# EasyEDA Pro project ELECAP.eprj, board PCB1
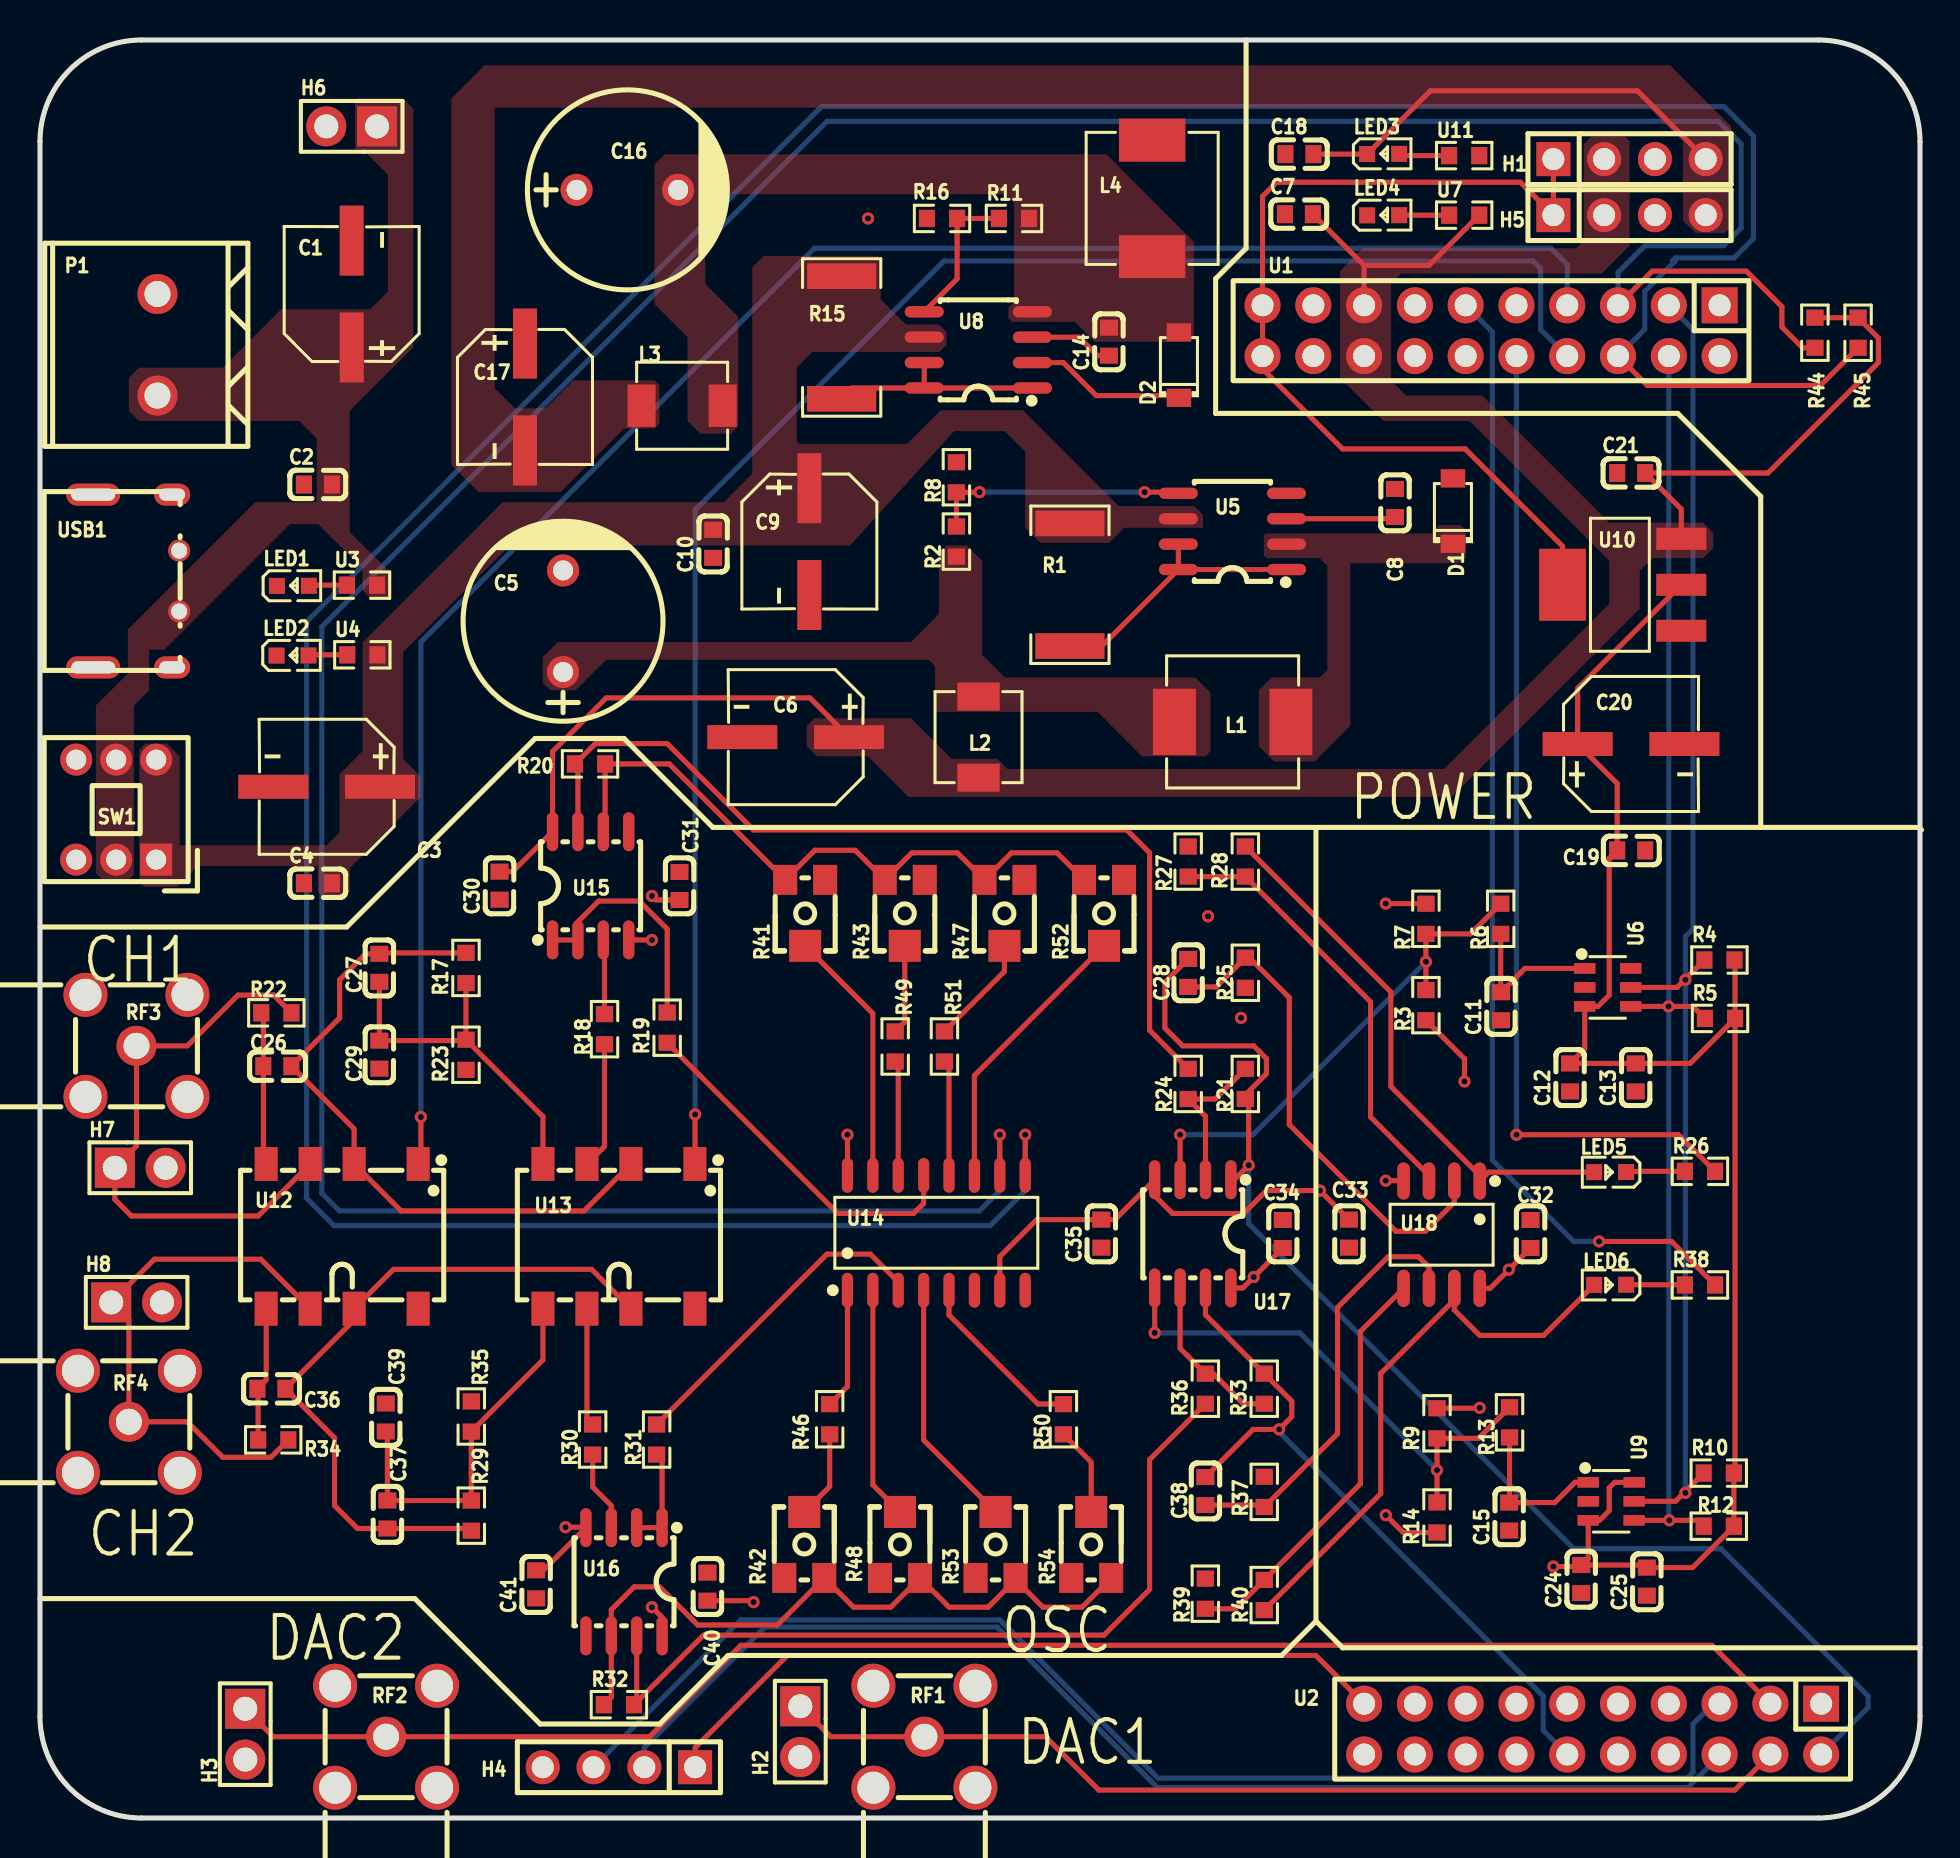
[diagram p2: board, top side]
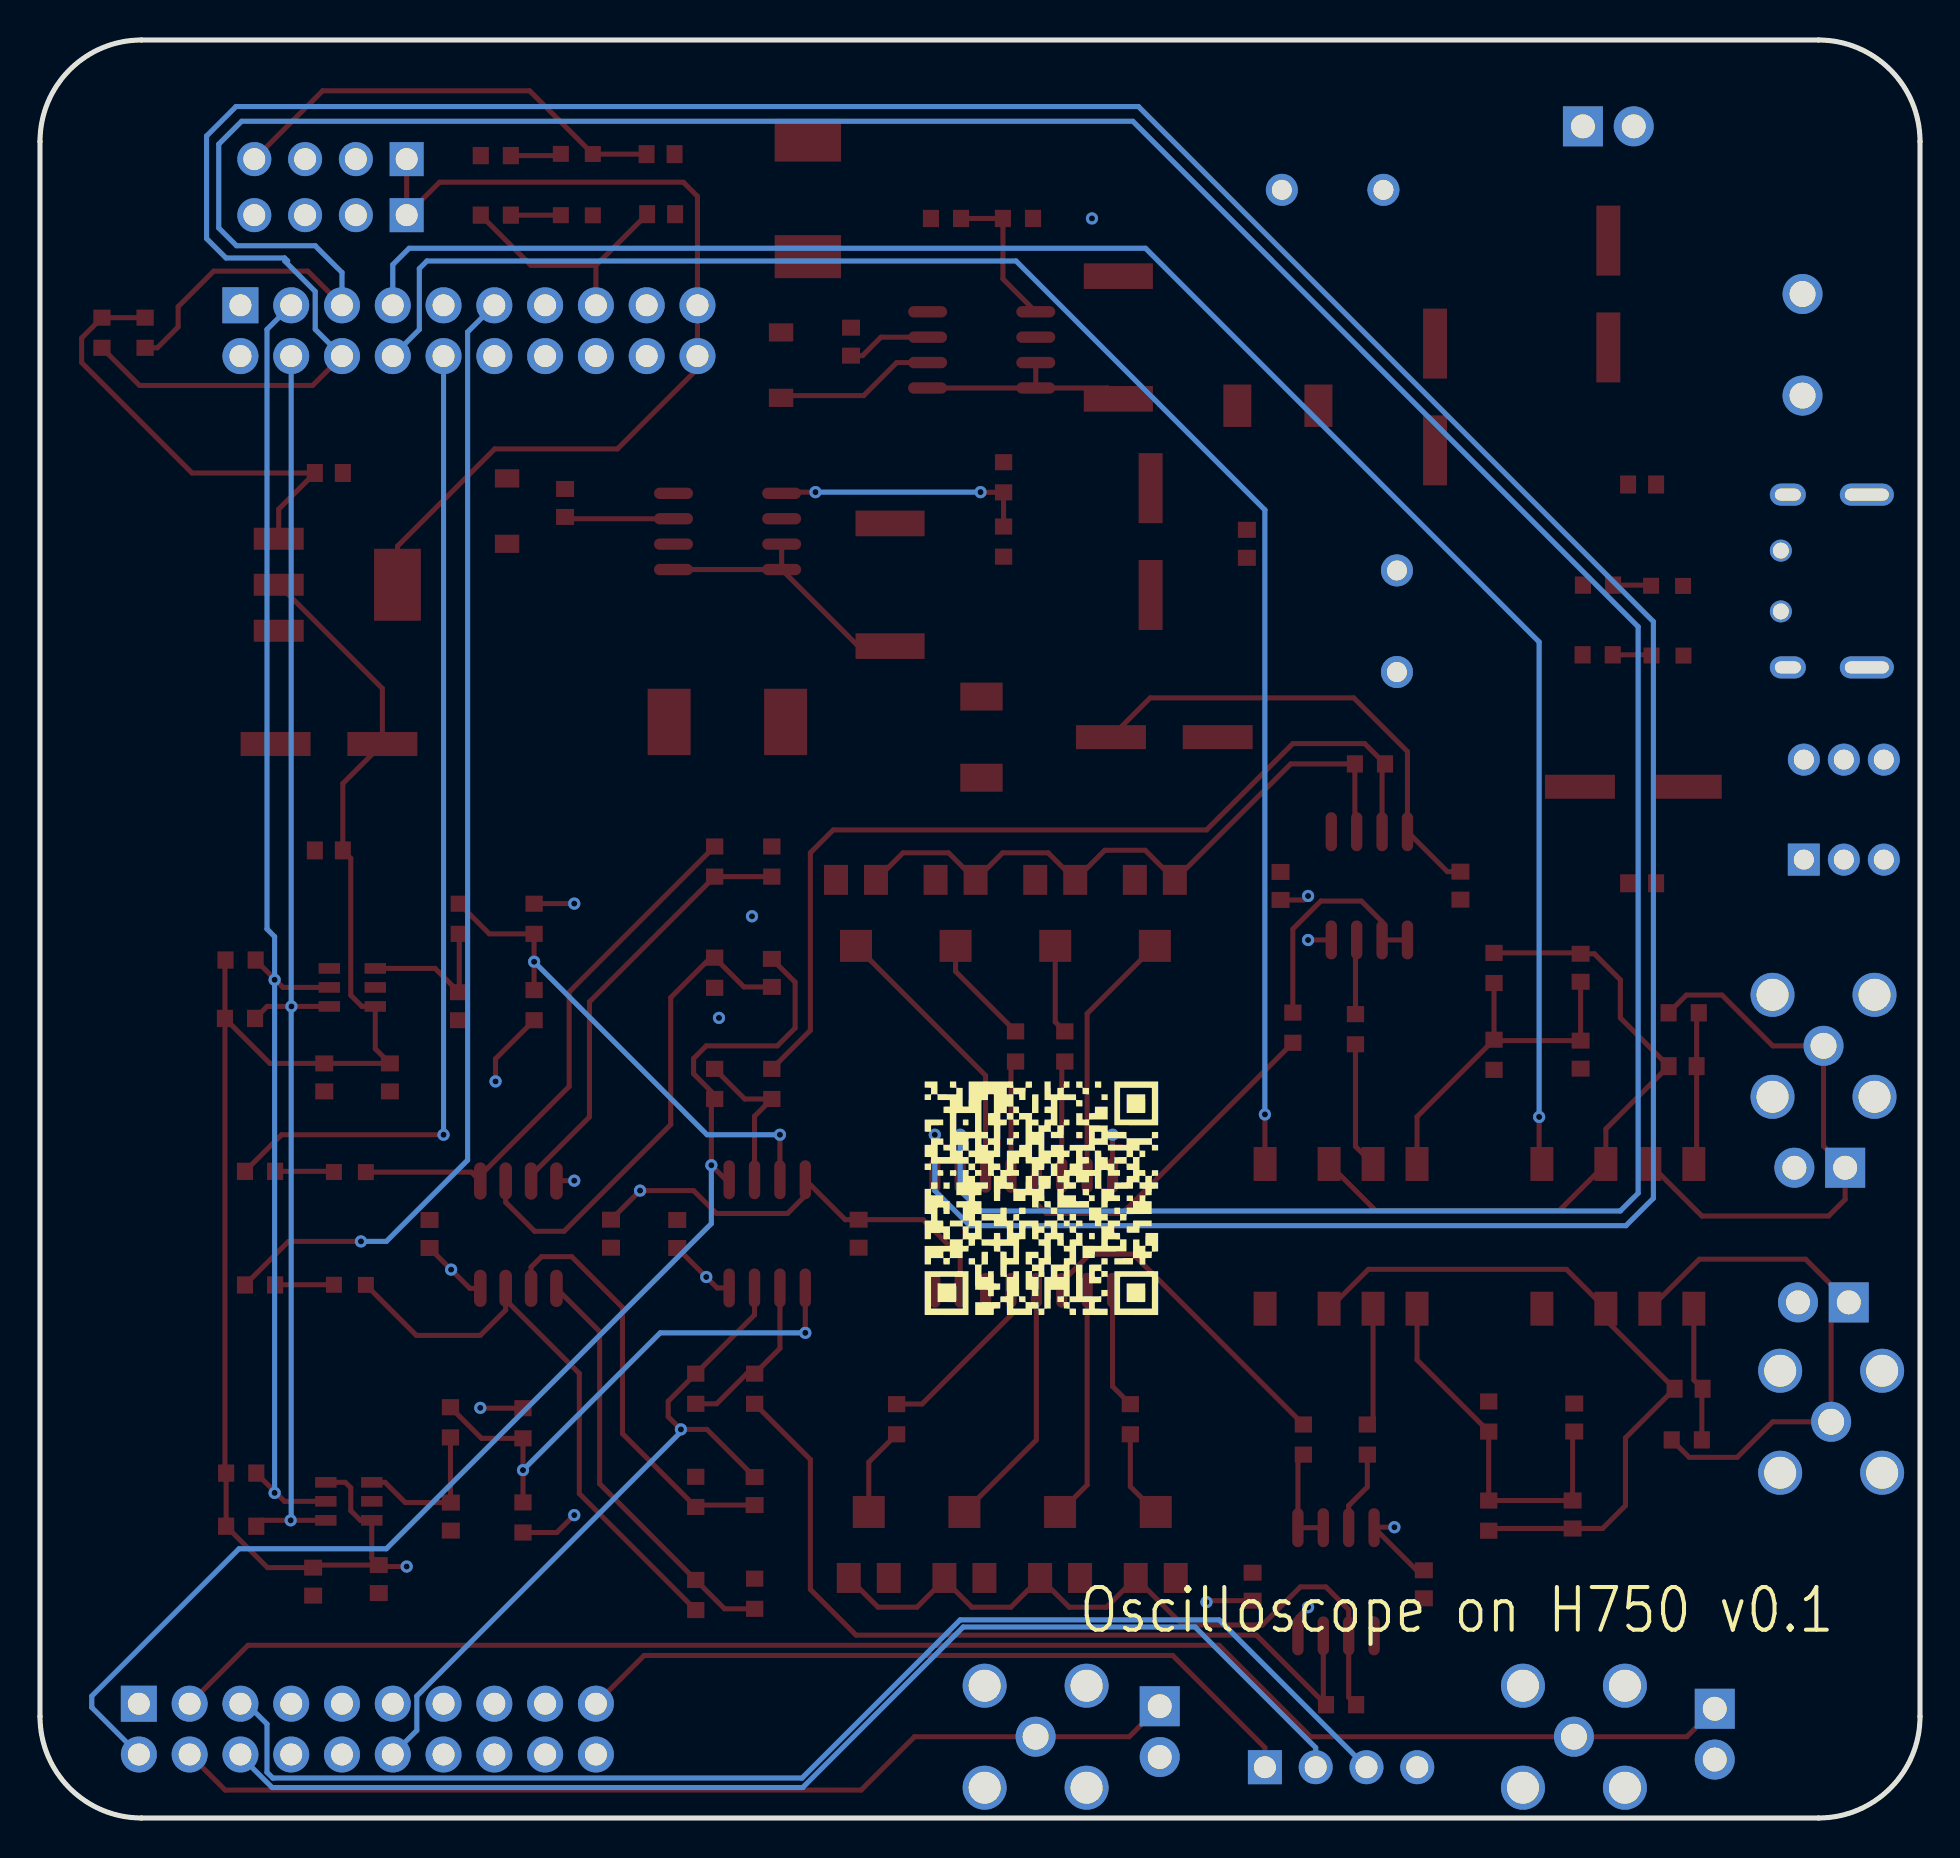
[diagram p3: board, bottom side, seen from below]

Outline 94.03 x 88.9 mm; copper layers: Top Layer, Inner1, Inner2, Bottom Layer. Coordinates in mm from the lower left corner of the outline.
Outline path: 0,83.82 0,5.08 arc(1.49,1.49) 5.08,0 88.95,0 arc(92.54,1.49) 94.03,5.08 94.03,83.82 arc(92.54,87.41) 88.95,88.9 5.08,88.9 arc(1.49,87.41) 0,83.82
Stack: Top Layer 0.035mm 外层铜厚1oz / Dielectric1 0.2104mm 7628 RC49% 8.6mil / Inner1 0.0152mm 内层铜厚 / Dielectric2 1.065mm 1.1mm H/HOZ 含铜 / Inner2 0.0152mm 内层铜厚 / Dielectric3 0.2104mm 7628 RC49% 8.6mil / Bottom Layer 0.035mm 外层铜厚1oz

## Design rules (mm)
template: JLCPCB Capability(Two Layers Board)
spacing copperThickness1oz (default): track to track 0.102, other pairs 0.152 to 0.3
spacing copperThickness2oz: track to track 0.203, other pairs 0.152 to 0.3
track width copperThickness1oz (default): min 0.127, default 0.254, max 2.54
track width copperThickness2oz: min 0.203, default 0.254, max 2.54
differential pair differentialPair (default): width min 0.127, default 0.254, max 2.54; gap min 0.152, default 0.152
via viaSize (default): diameter min 0.5, default 0.61, max 10; hole min 0.3, default 0.305, max 6.3

## Placement (name value [footprint] x y rotation side)
C1  100uF  [CAP-SMD_BD6.3-L6.6-W6.6-LS7.4-FD]  15.59 76.2 90 top
C2  100nF  [C0603]  13.9 66.67 0 top
C3  100uF  [CAP-SMD_BD6.3-L6.6-W6.6-LS7.4-FD]  14.34 51.56 180 top
C4  100nF  [C0603]  13.9 46.74 0 top
C5  1000uF  [CAP-TH_BD10.0-P5.00-D1.0-FD]  26.16 59.84 90 top
C6  100uF  [CAP-SMD_BD6.3-L6.6-W6.6-LS7.4-FD]  37.8 54.04 180 top
C7  100nF  [C0603]  62.96 80.19 0 top
C8  470pF  [C0603]  67.77 65.75 270 top
C9  100uF  [CAP-SMD_BD6.3-L6.6-W6.6-LS7.4-FD]  38.48 63.82 270 top
C10  100nF  [C0603]  33.67 63.71 90 top
C11  100nF  [C0603]  73.08 40.59 90 top
C12  100nF  [C0603]  76.53 37.03 90 top
C13  10uF  [C0603]  79.81 37.03 90 top
C14  470pF  [C0603]  53.47 73.82 90 top
C15  100nF  [C0603]  73.48 15.07 90 top
C16  1000uF  [CAP-TH_BD10.0-P5.00-D1.0-FD]  29.38 81.41 0 top
C17  100uF  [CAP-SMD_BD6.3-L6.6-W6.6-LS7.4-FD]  24.26 71.05 270 top
C18  100nF  [C0603]  62.99 83.19 0 top
C19  100nF  [C0603]  79.58 48.38 180 top
C20  100uF  [CAP-SMD_BD6.3-L6.6-W6.6-LS7.4-FD]  79.58 53.7 0 top
C21  100nF  [C0603]  79.58 67.25 0 top
C24  100nF  [C0603]  77.09 11.95 90 top
C25  10uF  [C0603]  80.37 11.82 90 top
C26  3.3uF  [C0603]  11.87 37.59 180 top
C27  10pF  [C0603]  16.98 42.51 90 top
C28  3.3uF  [C0603]  57.43 42.25 270 top
C29  220pF  [C0603]  16.98 38.17 90 top
C30  100nF  [C0603]  22.99 46.62 90 top
C31  100nF  [C0603]  31.99 46.6 270 top
C32  100nF  [C0603]  74.55 29.2 270 top
C33  100nF  [C0603]  65.47 29.22 90 top
C34  100nF  [C0603]  62.16 29.2 270 top
C35  100nF  [C0603]  53.09 29.22 90 top
C36  3.3uF  [C0603]  11.57 21.46 180 top
C37  10pF  [C0603]  17.38 15.18 270 top
C38  3.3uF  [C0603]  58.29 16.35 270 top
C39  220pF  [C0603]  17.3 20.02 270 top
C40  100nF  [C0603]  33.38 11.57 270 top
C41  100nF  [C0603]  24.82 11.68 90 top
D1  1N5819HW-7-F  [SOD-123_L2.7-W1.6-LS3.7-RD]  70.67 65.34 90 top
D2  1N5819HW-7-F  [SOD-123_L2.7-W1.6-LS3.7-RD]  56.97 72.64 90 top
H1  PZ254V-11-04P  [HDR-TH_4P-P2.54-V-M]  79.5 82.94 0 top
H2  PZ254V-11-02P  [HDR-TH_2P-P2.54-V-M]  38.03 4.32 270 top
H3  PZ254V-11-02P  [HDR-TH_2P-P2.54-V-M]  10.27 4.19 270 top
H4  PZ254V-11-04P  [HDR-TH_4P-P2.54-V-M]  28.96 2.54 180 top
H5  PZ254V-11-04P  [HDR-TH_4P-P2.54-V-M]  79.5 80.14 0 top
H6  PZ254V-11-02P  [HDR-TH_2P-P2.54-V-M]  15.59 84.58 180 top
H7  PZ254V-11-02P  [HDR-TH_2P-P2.54-V-M]  5.01 32.51 0 top
H8  PZ254V-11-02P  [HDR-TH_2P-P2.54-V-M]  4.83 25.78 0 top
L1  100uH  [IND-SMD_L7.1-W6.6]  59.65 54.8 180 top
L2  1uH  [IND-SMD_L4.4-W4.2]  46.94 54.04 90 top
L3  1uH  [IND-SMD_L4.4-W4.2]  32.12 70.61 0 top
L4  100uH  [IND-SMD_L7.1-W6.6]  55.63 80.98 270 top
LED1  NCD0603R1  [LED0603-RD_RED]  12.65 61.61 0 top
LED2  NCD0603R1  [LED0603-RD_RED]  12.63 58.12 0 top
LED3  NCD0603R1  [LED0603-RD_RED]  67.18 83.2 0 top
LED4  NCD0603R1  [LED0603-RD_RED]  67.18 80.14 0 top
LED5  NCD0603R1  [LED0603-RD_RED]  78.53 32.3 180 top
LED6  NCD0603R1  [LED0603-RD_RED]  78.53 26.66 180 top
P1  WJ500V-5.08-2P  [CONN-TH_2P-P5.00_WJ500V-5.08-2P]  5.88 73.66 90 top
R1  33mΩ  [R2512]  51.51 61.66 270 top
R2  3.6kΩ  [R0603]  45.84 63.82 270 top
R3  47kΩ  [R0603]  69.32 40.64 270 top
R4  1.5kΩ  [R0603]  84 42.9 0 top
R5  1.5kΩ  [R0603]  84.03 39.98 0 top
R6  100kΩ  [R0603]  73.06 44.96 270 top
R7  47kΩ  [R0603]  69.32 44.96 270 top
R8  1.2kΩ  [R0603]  45.84 67.04 270 top
R9  47kΩ  [R0603]  69.87 19.74 90 top
R10  1.5kΩ  [R0603]  83.97 17.25 0 top
R11  1.2kΩ  [R0603]  48.72 79.98 0 top
R12  1.5kΩ  [R0603]  83.97 14.59 0 top
R13  100kΩ  [R0603]  73.5 19.78 270 top
R14  47kΩ  [R0603]  69.87 15.03 90 top
R15  33mΩ  [R2512]  40.1 74.03 270 top
R16  3.6kΩ  [R0603]  45.12 79.98 0 top
R17  953kΩ  [R0603]  21.31 42.5 90 top
R18  33Ω  [R0603]  28.24 39.44 90 top
R19  33Ω  [R0603]  31.37 39.52 270 top
R20  100kΩ  [R0603]  27.51 52.7 180 top
R21  6.8kΩ  [R0603]  60.29 36.7 270 top
R22  100kΩ  [R0603]  11.82 40.26 180 top
R23  47kΩ  [R0603]  21.31 38.16 90 top
R24  6.8kΩ  [R0603]  57.43 36.7 270 top
R25  160kΩ  [R0603]  60.29 42.26 90 top
R26  33Ω  [R0603]  83.03 32.33 0 top
R27  3.6kΩ  [R0603]  57.43 47.82 270 top
R28  160kΩ  [R0603]  60.29 47.82 90 top
R29  953kΩ  [R0603]  21.57 15.12 270 top
R30  33Ω  [R0603]  27.64 18.92 270 top
R31  33Ω  [R0603]  30.84 18.92 90 top
R32  100kΩ  [R0603]  28.96 5.66 0 top
R33  6.8kΩ  [R0603]  61.23 21.46 90 top
R34  100kΩ  [R0603]  11.67 18.91 180 top
R35  47kΩ  [R0603]  21.57 20.07 270 top
R36  6.8kΩ  [R0603]  58.29 21.46 90 top
R37  160kΩ  [R0603]  61.23 16.31 270 top
R38  33Ω  [R0603]  83.03 26.65 0 top
R39  3.6kΩ  [R0603]  58.29 11.21 270 top
R40  160kΩ  [R0603]  61.23 11.15 270 top
R41  2.2kΩ  [RES-ADJ-SMD_VG039NCH]  38.27 45.26 90 top
R42  2.2kΩ  [RES-ADJ-SMD_VG039NCH]  38.23 13.65 270 top
R43  2.2kΩ  [RES-ADJ-SMD_VG039NCH]  43.25 45.26 90 top
R44  1kΩ  [R0603]  88.77 74.26 90 top
R45  1kΩ  [R0603]  90.93 74.26 90 top
R46  8.2kΩ  [R0603]  39.5 19.94 270 top
R47  2.2kΩ  [RES-ADJ-SMD_VG039NCH]  48.24 45.26 90 top
R48  2.2kΩ  [RES-ADJ-SMD_VG039NCH]  43.01 13.65 270 top
R49  3kΩ  [R0603]  42.77 38.58 270 top
R50  3kΩ  [R0603]  51.19 19.94 270 top
R51  8.2kΩ  [R0603]  45.24 38.58 270 top
R52  2.2kΩ  [RES-ADJ-SMD_VG039NCH]  53.22 45.26 90 top
R53  2.2kΩ  [RES-ADJ-SMD_VG039NCH]  47.79 13.65 270 top
R54  2.2kΩ  [RES-ADJ-SMD_VG039NCH]  52.58 13.65 270 top
RF1  BWSMA-KWE-Z001  [SMA-TH_BWSMA-KWE-Z001]  44.23 4.06 270 top
RF2  BWSMA-KWE-Z001  [SMA-TH_BWSMA-KWE-Z001]  17.31 4.06 270 top
RF3  BWSMA-KWE-Z001  [SMA-TH_BWSMA-KWE-Z001]  4.83 38.61 180 top
RF4  BWSMA-KWE-Z001  [SMA-TH_BWSMA-KWE-Z001]  4.45 19.81 180 top
SW1  XKB7070-Z  [SW-TH_6P-L7.0-W7.0-P2.00]  3.81 50.42 270 top
U1  PM254-2-10-Z-8.5  [HDR-TH_20P-P2.54-V-F-R2-C10-S2.54]  72.58 74.36 180 top
U2  PM254-2-10-Z-8.5  [HDR-TH_20P-P2.54-V-F-R2-C10-S2.54]  77.66 4.44 180 top
U3  5kΩ  [R0603]  16.11 61.64 0 top
U4  5kΩ  [R0603]  16.12 58.16 0 top
U5  MC34063ADR2G  [SOIC-8_L5.0-W4.0-P1.27-LS6.0-BL]  59.64 64.33 90 top
U6  MCP4725A0T-E/CH  [SOT-23-6_L2.9-W1.6-P0.95-LS2.8-BL]  78.41 41.53 270 top
U7  5kΩ  [R0603]  71.23 80.14 0 top
U8  MC34063ADR2G  [SOIC-8_L5.0-W4.0-P1.27-LS6.0-BL]  46.93 73.41 90 top
U9  MCP4725A0T-E/CH  [SOT-23-6_L2.9-W1.6-P0.95-LS2.8-BL]  78.59 15.83 270 top
U10  AMS1117-3.3  [SOT-223-3_L6.5-W3.4-P2.30-LS7.0-BR]  79.12 61.66 0 top
U11  5kΩ  [R0603]  71.23 83.12 0 top
U12  G6K-2F-Y-TR DC3  [RELAY-SMD_G6K-2F-Y]  15.11 29.08 180 top
U13  G6K-2F-Y-TR DC3  [RELAY-SMD_G6K-2F-Y]  28.96 29.08 180 top
U14  CD4052BM/TR  [SOP-16_L10.0-W3.9-P1.27-LS6.0-BL]  44.83 29.26 0 top
U15  TL072CDR  [SOIC-8_L4.9-W3.9-P1.27-LS6.1-BL]  27.54 46.61 0 top
U16  TL072CDR  [SOIC-8_L4.9-W3.9-P1.27-LS6.1-BL]  29.21 11.81 180 top
U17  TL072CDR  [SOIC-8_L4.9-W3.9-P1.27-LS6.1-BL]  57.66 29.21 180 top
U18  LM393  [SOP-8_L4.9-W3.9-P1.27-LS6.0-BL]  70.1 29.17 180 top
USB1  TYPE-C-31-M-33  [USB-C-TH_TYPE-C-31-M-33]  4.81 61.85 270 top

## Footprints (pads in the part's own frame, mm; a bottom-side part is the same pattern mirrored in y, then rotated)
C0603
  rect 0.8x0.9 smd: 1(-0.7,0) 2(0.7,0)
CAP-SMD_BD6.3-L6.6-W6.6-LS7.4-FD
  rect 3.5x1.2 smd: 1(-2.67,0) 2(2.67,0)
CAP-TH_BD10.0-P5.00-D1.0-FD
  round 1.6 hole 1: 1(-2.54,0) 2(2.54,0)
CONN-TH_2P-P5.00_WJ500V-5.08-2P
  round 2 hole 1.3: 1(-2.54,0) 2(2.54,0)
HDR-TH_2P-P2.54-V-M
  rect 2x2 hole 1.2: 1(-1.27,0)
  round 2 hole 1.2: 2(1.27,0)
HDR-TH_4P-P2.54-V-M
  rect 1.7x1.7 hole 1.1: 1(-3.81,0)
  round 1.7 hole 1.1: 2(-1.27,0) 3(1.27,0) 4(3.81,0)
HDR-TH_20P-P2.54-V-F-R2-C10-S2.54
  rect 1.8x1.8 hole 1.1: 1(-11.43,-1.27)
  round 1.8 hole 1.1: 2(-11.43,1.27) 3(-8.89,-1.27) 4(-8.89,1.27) 5(-6.35,-1.27) 6(-6.35,1.27) 7(-3.81,-1.27) 8(-3.81,1.27) 9(-1.27,-1.27) 10(-1.27,1.27) 11(1.27,-1.27) 12(1.27,1.27) 13(3.81,-1.27) 14(3.81,1.27) 15(6.35,-1.27) 16(6.35,1.27) 17(8.89,-1.27) 18(8.89,1.27) 19(11.43,-1.27) 20(11.43,1.27)
IND-SMD_L4.4-W4.2
  rect 1.4x2.12 smd: 1(2.028,0) 2(-2.028,0)
IND-SMD_L7.1-W6.6
  rect 2.15x3.32 smd: 1(-2.913,0) 2(2.913,0)
LED0603-RD_RED
  rect 0.8x0.8 smd: 1(-0.799,-0.004) 2(0.799,0.004)
R0603
  rect 0.806x0.864 smd: 1(-0.753,0) 2(0.753,0)
R2512
  rect 1.282x3.456 smd: 1(-3.067,0) 2(3.067,0)
RELAY-SMD_G6K-2F-Y
  rect 1.15x1.7 smd: 1(-3.8,-3.618) 2(-0.6,-3.618) 3(1.6,-3.618) 4(3.8,-3.618) 5(3.8,3.618) 6(1.6,3.618) 7(-0.6,3.618) 8(-3.8,3.618)
RES-ADJ-SMD_VG039NCH
  rect 1.5x1.2 smd: 1(1.65,-1) 3(1.65,1)
  rect 1.6x1.6 smd: 2(-1.65,0)
SMA-TH_BWSMA-KWE-Z001
  round 2.2 hole 1.6: 1(-2.55,-2.55) 2(-2.55,2.55) 3(2.55,2.55) 4(2.55,-2.55)
  round 2 hole 1.3: 5(0,0)
SOD-123_L2.7-W1.6-LS3.7-RD
  rect 0.91x1.22 smd: 1(-1.635,0) 2(1.635,0)
SOIC-8_L4.9-W3.9-P1.27-LS6.1-BL
  oval 0.569x1.95 smd: 1(-1.905,-2.705) 2(-0.635,-2.705) 3(0.635,-2.705) 4(1.905,-2.705) 5(1.905,2.705) 6(0.635,2.705) 7(-0.635,2.705) 8(-1.905,2.705)
SOIC-8_L5.0-W4.0-P1.27-LS6.0-BL
  oval 0.569x1.95 smd: 1(-1.905,-2.705) 2(-0.635,-2.705) 3(0.635,-2.705) 4(1.905,-2.705) 5(1.905,2.705) 6(0.635,2.705) 7(-0.635,2.705) 8(-1.905,2.705)
SOP-8_L4.9-W3.9-P1.27-LS6.0-BL
  oval 0.63x1.865 smd: 1(-1.905,-2.683) 2(-0.635,-2.683) 3(0.635,-2.683) 4(1.905,-2.683) 5(1.905,2.683) 6(0.635,2.683) 7(-0.635,2.683) 8(-1.905,2.683)
SOP-16_L10.0-W3.9-P1.27-LS6.0-BL
  oval 0.56x1.745 smd: 1(-4.445,-2.873) 2(-3.175,-2.873) 3(-1.905,-2.873) 4(-0.635,-2.873) 5(0.635,-2.873) 6(1.905,-2.873) 7(3.175,-2.873) 8(4.445,-2.873) 9(4.445,2.873) 10(3.175,2.873) 11(1.905,2.873) 12(0.635,2.873) 13(-0.635,2.873) 14(-1.905,2.873) 15(-3.175,2.873) 16(-4.445,2.873)
SOT-23-6_L2.9-W1.6-P0.95-LS2.8-BL
  rect 0.532x1.072 smd: 1(-0.95,-1.149) 2(0,-1.149) 3(0.95,-1.149) 4(0.95,1.149) 5(0,1.149) 6(-0.95,1.149)
SOT-223-3_L6.5-W3.4-P2.30-LS7.0-BR
  rect 2.5x1.1 smd: 1(2.97,-2.3) 2(2.97,0) 3(2.97,2.3)
  rect 2.34x3.6 smd: 4(-2.97,0)
SW-TH_6P-L7.0-W7.0-P2.00
  rect 1.6x1.6 hole 1: 1(2.499,2)
  round 1.6 hole 1: 2(2.5,0) 3(2.5,-2) 4(-2.5,2) 5(-2.5,0) 6(-2.5,-2)
USB-C-TH_TYPE-C-31-M-33
  oval 1.1x1.8 hole 0.6x1.3: 3(4.32,1.8) 6(-4.32,1.8)
  oval 1.1x2.7 hole 0.6x2.2: 4(4.32,-2.15) 5(-4.32,-2.15)
  round 1.1 hole 0.8: A9(1.52,2.15) B12(-1.52,2.15)

## Nets
As in the schematic.

Pads without a net: R41 1; R42 1; R43 1; R47 1; R48 1; R52 1; R53 1; R54 1; SW1 3 6

## Via types
v1: diameter 0.61, hole 0.305, Top Layer to Bottom Layer, 36 vias

## Routing (per net, layer and track width the routed paths; a pad name or vN(x,y) marks a point on that pad's centre or on a via; arc(x,y) is an arc through that point)
+5V: length 303.5
  Top Layer w0.254: C30.2 23.64,47.32 U15.8 25.64,53.32 28.32,56.01 38.5,56.01 C6.1 ; v1(40.39,34.16) U14.16 ; C34.2 60.16,26.5 U17.8 ; v1(35.69,10.79) 35.62,10.87 C40.2 ; 88.77,75.02 90.93,75.02 91.95,74 91.95,72.77 86.43,67.25 C21.2 82.09,65.44 82.09,63.96 ; C32.2 v1(73.47,27.42) 72.53,26.48 U18.8 ; R3.2 71.25,37.96 v1(71.25,36.83) ; U7.2 69.47,77.63 66.23,77.63 ; C7.2 66.23,77.63 ; 66.23,77.63 U1.15 ; v1(72.01,20.51) 71.99,20.49 R9.2 ; v1(30.61,10.54) 31.12,10.03 U16.8
  Inner2 w0.254: v1(30.61,10.54) 30.86,10.79 v1(35.69,10.79) 36.7,9.78 67.06,9.78 72.01,14.73 v1(72.01,20.51) 72.01,22.61 74.17,24.77 74.17,26.67 71.25,29.59 v1(71.25,36.83) 73.15,38.73 75.31,38.73 89.53,52.96 89.53,75.69 84.71,80.52 84.71,83.44 83.31,84.84 75.43,84.84 U1.15 U1.16 66.23,60 v1(40.39,34.16) 40.39,32 43.94,28.45 59.31,28.45 v1(60.71,27.05)
-5V: length 222.4
  Top Layer w0.254: R14.1 68.18,14.27 v1(67.31,15.15) ; U14.7 48.01,28.07 49.86,29.92 C35.2 53.76,29.92 U17.4 55.75,31.11 56.64,30.23 60.2,30.23 61.34,31.37 v1(64.02,31.37) C33.2 ; C41.2 25.17,12.38 27.31,14.52 27.28,14.54 v1(26.29,14.54) ; v1(30.61,46.1) 30.81,45.9 C31.2 ; C18.2 66.37,83.19 LED3.1 69.54,86.36 79.9,86.36 H1.4 ; v1(30.61,43.9) 30.6,43.9 U15.4 ; v1(67.31,31.87) 68.18,31.87 U18.4 ; R7.1 69.31,45.72 v1(67.31,45.72)
  Inner2 w0.254: v1(30.61,46.1) v1(30.61,43.9) 30.61,40.13 26.29,35.81 v1(26.29,14.54) 26.29,13.97 28.45,11.81 66.04,11.81 67.31,13.08 v1(67.31,15.15) 67.31,31.37 ; H5.4 87.76,75.7 87.76,53.85 82.17,48.26 69.85,48.26 v1(67.31,45.72) v1(67.31,31.87) 67.31,31.37 ; 67.31,31.37 67.31,31.37 64.01,31.37
GND:
  vias: v1(41.42,79.98) v1(58.42,45.08) v1(60.07,40)
VCC: length 291.4
  Top Layer w0.254: R5.2 82.53,37.73 C13.2 C12.2 77.26,38.46 U6.3 77.92,40.58 78.49,41.14 78.49,47.98 C19.2 78.88,51.72 C20.1 76.91,56.48 U10.2 ; R5.2 84.78,42.87 R4.2 ; R5.2 84.78,17.31 R10.2 R12.2 82.65,12.52 C25.2 80.24,12.65 C24.2 ; v1(75.69,12.57) 77.01,12.57 C24.2 ; U2.19 63.81,8.13 37.38,8.13 32.77,3.52 H4.1 ; C24.2 77.44,13 U9.3 78,14.88 78.49,15.37 78.49,16.51 78.76,16.78 U9.6 ; H1.1 H5.1 74.05,81.79 61.85,81.79 61.15,81.09 U1.19 U1.20 61.15,72.46 65.15,68.45 71.29,68.45 76.15,63.59 U10.4
  Inner2 w0.254: U2.20 U2.19 73.08,12.57 v1(75.69,12.57) 90.93,27.81 90.93,76.2 85.72,81.41 85.72,83.82 83.19,86.36 71.87,86.36 U1.19
CH1_AC: length 7.7
  Top Layer w0.254: R22.2 11.17,40.15 C26.2 11.17,32.84 U12.4
CH1_AFTER_RES: length 33.3
  Top Layer w0.254: U15.6 28.27,49.4 R20.1 31.47,52.7 R41.3 38.75,48.39 40.77,48.39 R43.3 43.61,48.26 45.88,48.26 R47.3 48.59,48.26 50.87,48.26 R52.3
CH1_BEFORE_AMP: length 18
  Top Layer w0.254: R19.2 39.91,30.23 43.69,30.23 44.2,30.73 44.2,32.13
CH1_BY20: length 17.9
  Top Layer w0.254: R23.2 R17.1 ; R23.2 21.26,38.87 C29.2 C27.1 ; R23.2 25.16,35.06 25.16,32.7
CH1_DC: length 34.2
  Top Layer w0.254: U13.2 27.21,30.35 18.06,30.35 U12.2 15.71,34.45 C26.1 14.99,40 14.99,41.91 16.29,43.21 C27.2 17.02,43.26 R17.2
CH1_IN: length 28.5
  Top Layer w0.254: U12.3 10.91,30.1 4.57,30.1 3.74,30.93 3.74,32.51 4.83,33.59 RF3.5 7.37,38.61 9.91,41.15 11.68,41.15 R22.1
CH1_SAMPLE: length 6.4
  Top Layer w0.254: 27.36,32.7 28.24,33.58 R18.1
CH2_AC: length 6.8
  Top Layer w0.254: R34.2 10.91,21.43 C36.2 11.31,21.9 U12.5
CH2_AFTER_RES: length 35.8
  Top Layer w0.254: 48.79,11.91 50.16,10.54 52.12,10.54 R54.3 ; 48.79,11.91 47.42,10.54 45.47,10.54 R48.3 42.55,10.54 40.69,10.54 R42.3 36.88,9.65 32.89,9.65 30.99,11.56 29.72,11.56 28.58,10.41 U16.6 28.58,6.04 R32.1 ; 48.79,11.91 R53.3
CH2_BEFORE_AMP: length 16.6
  Top Layer w0.254: R31.2 39.36,28.19 41.53,28.19 42.93,26.8 U14.3
CH2_BY20: length 18.8
  Top Layer w0.254: C39.2 17.38,19.24 C37.1 17.38,15.87 21.57,15.87 R35.2 25.16,22.91 25.16,25.47
CH2_DC: length 35.1
  Top Layer w0.254: R29.2 21.46,14.47 C37.2 15.88,14.47 14.73,15.62 14.73,19 C36.1 15.71,24.9 U12.7 17.68,27.43 27.59,27.43 U13.7
CH2_IN: length 27.3
  Top Layer w0.254: U12.6 11.04,27.94 5.72,27.94 H8.1 4.45,24.9 RF4.5 7.37,19.81 9.14,18.03 11.55,18.03 R34.1
CH2_SAMPLE: length 5.9
  Top Layer w0.254: 27.36,25.47 27.36,19.96 R30.1
DAC1_BIAS: length 25.3
  Top Layer w0.254: v1(57.02,34.16) U17.3 ; R3.1 v1(69.32,42.81) R7.2 71.55,44.21 R6.1
  Bottom Layer w0.254: v1(57.02,34.16) 60.67,34.16 v1(69.32,42.81)
DAC2_BIAS: length 26.7
  Top Layer w0.254: R14.2 v1(69.87,17.39) R9.1 71.95,18.98 R13.1 ; U17.5 v1(55.75,24.26)
  Bottom Layer w0.254: v1(69.87,17.39) 63.01,24.26 v1(55.75,24.26)
DAC_SCL: length 68.4
  Top Layer w0.254: R4.1 81.88,41.53 U6.5 ; U9.5 81.8,15.83 R10.1
  Bottom Layer w0.254: v1(82.3,16.26) v1(82.3,41.91) 82.3,44.07 82.68,44.45 82.68,74.42 U1.3
DAC_SDA: length 65.8
  Top Layer w0.254: R12.1 82.92,14.88 v1(81.49,14.88) U9.4 ; U6.4 v1(81.45,40.58) 82.67,40.58 R5.1
  Bottom Layer w0.254: U1.4 81.47,14.86
GPIO_ADC1: length 64.3
  Top Layer w0.254: C28.1 56.26,41.79 56.26,39.5 57.15,38.61 60.71,38.61 61.34,37.97 61.34,37.21 60.29,36.16 R21.2 60.45,35.78 v1(60.45,32.64) 59.73,31.91 U17.1
  Bottom Layer w0.254: v1(60.45,32.64) 60.45,29.72 76.71,13.46 84.07,13.46 91.44,6.1 91.44,5.53 U2.2
GPIO_ADC2: length 36.1
  Top Layer w0.254: C38.1 60.67,19.43 v1(61.98,19.43) 62.61,20.07 62.61,20.84 R33.2 58.29,25.16 U17.7
  Bottom Layer w0.254: 61.85,19.43 75.18,6.1 75.18,4.38 U2.12
GPIO_CD4052_A0: length 175.4
  Top Layer w0.254: R44.1 88.16,73.51 87.12,74.55 87.12,75.56 85.34,77.34 80.63,77.34 U1.5 ; v1(48.01,34.16) U14.10
  Bottom Layer w0.254: v1(48.01,34.16) 48.01,31.37 46.99,30.35 14.99,30.35 14.1,31.24 14.1,59.56 39.37,84.84 83.95,84.84 85.09,83.69 85.09,79.5 84.2,78.61 80.26,78.61 78.93,77.28 U1.5
GPIO_CD4052_A1: length 183.7
  Top Layer w0.254: v1(49.28,34.16) U14.9 ; R45.1 89.05,71.63 80.39,71.63 U1.6
  Bottom Layer w0.254: v1(49.28,34.16) 49.28,31.37 47.52,29.62 14.71,29.62 13.34,30.99 13.34,59.82 39.09,85.57 84.23,85.57 85.7,84.1 85.7,78.97 84.73,78 81.8,78 81.65,77.85 81.79,77.85 80.26,76.33 80.26,74.43 U1.6
GPIO_DAC1: length 51
  Top Layer w0.254: 38.03,5.59 39.55,4.06 RF1.5 50.29,4.06 52.96,1.4 84.77,1.4 U2.4
GPIO_DAC2: length 80
  Top Layer w0.254: H3.1 11.66,4.06 RF2.5 30.48,4.06 35.05,8.64 83.63,8.64 U2.3
GPIO_FREQ1: length 49.6
  Top Layer w0.254: R26.2 81.95,34.16 v1(73.85,34.16)
  Bottom Layer w0.254: U1.10 v1(73.85,34.16)
GPIO_FREQ2: length 57
  Top Layer w0.254: v1(77.98,28.83) 81.6,28.83 R38.2
  Bottom Layer w0.254: v1(77.98,28.83) 76.71,28.83 72.64,32.89 72.64,74.3 U1.11
GPIO_SW1: length 94
  Top Layer w0.254: U12.1 19.05,32.84 v1(19.05,35.05)
  Bottom Layer w0.254: U1.7 76.39,77.66 75.56,78.49 38.74,78.49 19.05,58.8 v1(19.05,35.05)
GPIO_SW2: length 85.2
  Top Layer w0.254: 32.76,32.7 32.77,32.71 v1(32.77,35.18)
  Bottom Layer w0.254: U1.8 75.06,74.42 75.06,77.47 74.68,77.85 45.21,77.85 32.77,65.41 v1(32.77,35.18)
UART1_RX: length 65.6
  Bottom Layer w0.254: U2.5 83.69,5.72 82.68,4.7 82.68,2.29 82.39,2 55.92,2 48.01,9.91 35.05,9.91 H4.3
UART1_TX: length 61.3
  Bottom Layer w0.254: H4.2 30.23,3.52 36.26,9.55 47.86,9.55 55.88,1.52 82.42,1.52 84.01,3.11 U2.6
$1N1475: length 1.9
  Top Layer w0.254: 15.35,61.64 13.48,61.64 LED1.2
$1N1576: length 2
  Top Layer w0.254: 15.37,58.16 13.46,58.16 LED2.2
$1N1922: length 5.5
  Top Layer w0.254: U5.3 67.68,64.96 C8.2
$1N2334: length 12.8
  Top Layer w0.254: U5.5 56.88,66.29 v1(55.25,66.29) ; R2.1 R8.2 46.98,66.28 v1(46.99,66.29)
  Bottom Layer w0.254: v1(46.99,66.29) v1(55.25,66.29)
$1N2471: length 13.7
  Top Layer w0.254: U5.8 53.11,58.6 R1.2 ; U5.8 56.94,63.69 ; U5.8 U5.1
$1N3516: length 7.4
  Top Layer w0.254: U8.5 45.87,76.95 45.87,79.98 R11.1
$1N3519: length 11
  Top Layer w0.254: R15.2 40.64,71.5 U8.8 ; U8.8 49.64,71.5 ; U8.8 U8.7
$1N3959: length 8.1
  Top Layer w0.254: D2.1 56.85,71.12 52.83,71.12 51.18,72.77 49.64,72.77
$1N3963: length 4.2
  Top Layer w0.254: C14.1 52.89,73.12 51.97,74.04 49.64,74.04
$1N4188: length 2.5
  Top Layer w0.254: LED4.2 70.48,80.14 U7.1
$1N4271: length 2.5
  Top Layer w0.254: U11.1 68.07,83.12 LED3.2
$1N10509: length 3.7
  Top Layer w0.254: R18.2 28.24,43.84 U15.3
$1N10723: length 11.8
  Top Layer w0.254: U15.1 U15.2 26.91,44.81 27.94,45.85 29.97,45.85 31.37,44.45 R19.1
$1N11101: length 5.8
  Top Layer w0.254: R51.2 45.47,37.59 U14.12
$1N11140: length 5.8
  Top Layer w0.254: R49.2 42.93,37.67 U14.14
$1N11181: length 4.5
  Top Layer w0.254: R43.2 43.25,39.81 R49.1
$1N11262: length 5.5
  Top Layer w0.254: R47.2 48.24,42.33 R51.1
$1N11378: length 14.2
  Top Layer w0.254: U14.11 46.74,37.12 R52.2
$1N12541: length 4
  Top Layer w0.254: R30.2 27.64,16.55 28.58,15.62 28.58,14.52
$1N12545: length 5
  Top Layer w0.254: 29.84,14.52 31.12,14.52 31.12,17.9 R31.1
$1N15287: length 6.1
  Top Layer w0.254: R46.1 40.39,21.58 U14.1
$1N15326: length 8.8
  Top Layer w0.254: U14.5 45.47,25.15 49.91,20.7 51.18,20.7 R50.1
$1N15478: length 4.4
  Top Layer w0.254: R42.2 39.5,16.57 R46.2
$1N15482: length 11.6
  Top Layer w0.254: U14.2 41.66,16.66 R48.2
$1N15487: length 12.6
  Top Layer w0.254: 44.2,26.39 44.2,18.9 R53.2
$1N15492: length 4.5
  Top Layer w0.254: R50.2 52.58,17.79 R54.2
$1N17808: length 25
  Top Layer w0.254: U18.2 70.74,30.79 69.29,29.34 67.82,29.34 62.48,34.67 62.48,41.02 60.49,43.02 R25.2 58.83,41.55 C28.2
$1N17849: length 21.9
  Top Layer w0.254: R27.2 R28.1 66.55,40.81 66.55,35.05 69.47,32.13 U18.3
$1N17946: length 27.5
  Top Layer w0.254: R28.2 67.56,41.3 67.56,36.58 72.01,32.13 U18.1 72.46,32.29 LED5.2
$1N17988: length 3
  Top Layer w0.254: LED5.1 79.36,32.33 82.27,32.33
$1N18439: length 21.4
  Top Layer w0.254: U18.6 69.47,27.54 68.94,28.07 67.44,28.07 64.9,25.53 64.9,19.22 R37.2 61.14,15.65 C38.2
$1N18445: length 21
  Top Layer w0.254: U18.5 66.04,24.32 66.04,16.71 R40.1 59.79,10.46 R39.2
$1N18449: length 29.1
  Top Layer w0.254: LED6.2 75.21,24.13 72.01,24.13 70.74,25.4 70.74,25.91 ; 70.74,25.91 67.06,22.22 67.06,16.22 R40.2 ; 70.74,25.91 U18.7
$1N18453: length 2.9
  Top Layer w0.254: LED6.1 82.26,26.66 82.27,26.65
$1N20154: length 46.5
  Top Layer w0.254: R24.1 55.5,39.39 55.5,48.26 54.36,49.4 35.69,49.4 31.37,53.72 27.77,53.72 R20.2 26.91,52.56 U15.7
$1N20167: length 41.9
  Top Layer w0.254: 29.84,5.8 33.19,9.14 53.21,9.14 55.5,11.43 55.5,17.92 R36.1 ; 29.84,5.8 U16.7 ; 29.84,5.8 R32.2
$1N20194: length 7.9
  Top Layer w0.254: U17.2 58.29,35.08 R24.2 58.78,35.95 R21.1
$1N20199: length 8.4
  Top Layer w0.254: U17.6 57.02,23.48 R36.2 58.68,22.22 60.19,20.71 R33.1
$1N20301: length 7.6
  Top Layer w0.254: U6.1 74.27,42.48 C11.2 73.06,41.31 R6.2
$1N20347: length 7.6
  Top Layer w0.254: U9.1 76.77,16.78 75.76,15.77 C15.2 73.5,15.79 R13.2
$1N26193: length 12.9
  Top Layer w0.254: U14.15 41.66,40.22 R41.2

## Copper pours and planes (outline as drawn; the poured copper is in the pictures)
+5V on Top Layer: 38.35,84.21 83.69,84.21 83.69,51.05 38.35,51.05
-5V on Top Layer: 20.57,87.63 84.58,87.63 84.58,66.29 20.57,66.29
GND on Top Layer: -21.34,119.63 116.97,119.63 116.97,-23.11 -21.34,-23.11
GND on Bottom Layer: -69.6,159.77 161.8,159.77 161.8,-64.77 -69.6,-64.77
GND on Inner1: -38.61,128.27 129.67,128.27 129.67,-35.05 -38.61,-35.05
GND on Inner2: -51.69,141.99 142.75,141.99 142.75,-53.09 -51.69,-53.09
VIN on Top Layer: 4.96,78.11 58.17,78.11 58.17,46.03 4.96,46.03
$1N2869 on Top Layer: 25.15,63.63 58.55,63.63 58.55,53.09 25.15,53.09
$1N2953 on Top Layer: 60.96,64.64 71.33,64.64 71.33,52.83 60.96,52.83
$1N3967 on Top Layer: 30.73,83.19 57.71,83.19 57.71,69.22 30.73,69.22
$1N4579 on Top Layer: 2.79,85.98 18.67,85.98 18.67,46.82 2.79,46.82

## Text on the board
Bottom Silkscreen Layer: Oscilloscope on H750 v0.1
Top Silkscreen Layer: CH1 | CH2 | DAC2 | OSC | DAC1 | POWER
